# Altium schematic sheet CON_ETHERNET.SchDoc: Ethernet Connector
size A4; SheetNumber: 1; SheetTotal: 100
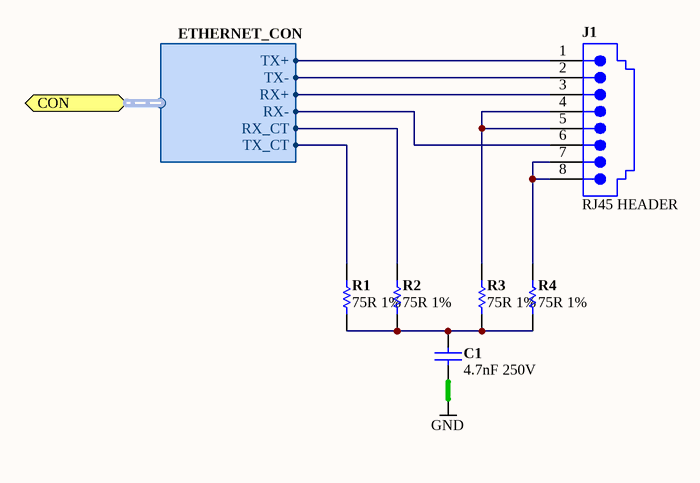
[diagram p0: CON_ETHERNET.SchDoc]

## Parts
C1  4.7nF 250V  [CAPM7163]
J1  RJ45 HEADER  [15-43-6233]
R1  75R 1%  [RESC1005-STAR]
R2  75R 1%  [RESC1005-STAR]
R3  75R 1%  [RESC1005-STAR]
R4  75R 1%  [RESC1005-STAR]

## Ports
CON (harness ETHERNET_CON)

## Harnesses
ETHERNET_CON: TX+, TX-, RX+, RX-, RX_CT, TX_CT

## Nets
GND: C1.1
NetC1_2: C1.2 R1.1 R2.1 R3.1 R4.1
NetJ1_1: J1.1 ; port CON.TX+
NetJ1_2: J1.2 ; port CON.TX-
NetJ1_3: J1.3 ; port CON.RX+
NetJ1_4: J1.4 J1.5 R3.2
NetJ1_6: J1.6 ; port CON.RX-
NetJ1_7: J1.7 J1.8 R4.2
NetR1_2: R1.2 ; port CON.TX_CT
NetR2_2: R2.2 ; port CON.RX_CT

## Notes on the sheet
- Sheet Title
- Project Title
- Size:
- Date:
- A4
- Assy:
- Time:
- Revision:
- Sheet
- of
- File:

## Library data of the parts
C1 = D-101-0019: Capacitor, Ceramic, 4.7nF 20% 250V Panasonic BC J Lead (CAPM7163) Y5V; Polarity: Non-Polarized; Tolerance: 20% %; Capacitance: 4.7 nF; Category: Capacitor; Dielectric: Y5V; Mounting Technology: Surface Mount; Rated Voltage: 250 V; Status: Production; Technology: Ceramic
J1 = D-300-0106: Connector, RJ45 Socket, Right-Angle, 8 Way (Ethernet), PCM8P8C; Max Current: mA; Category: Connector; Connector type: Header; Mounting Technology: Surface Mount; Status: Production
R1-R4 = D-100-0001: Resistor, 75R 1% 0402; Power Rating: mW; Resistance: mR; Category: Resistor; Mounting Technology: Surface Mount; Status: Production; Tolerance: 1 %